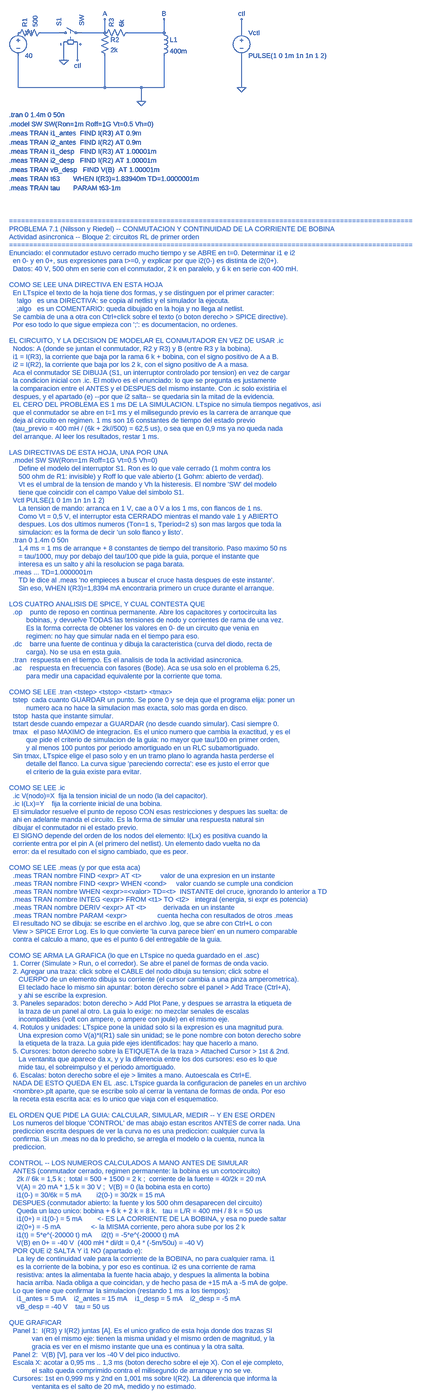
[diagram p0: schematic P7-01_conmutacion_continuidad_iL.asc, whole sheet]
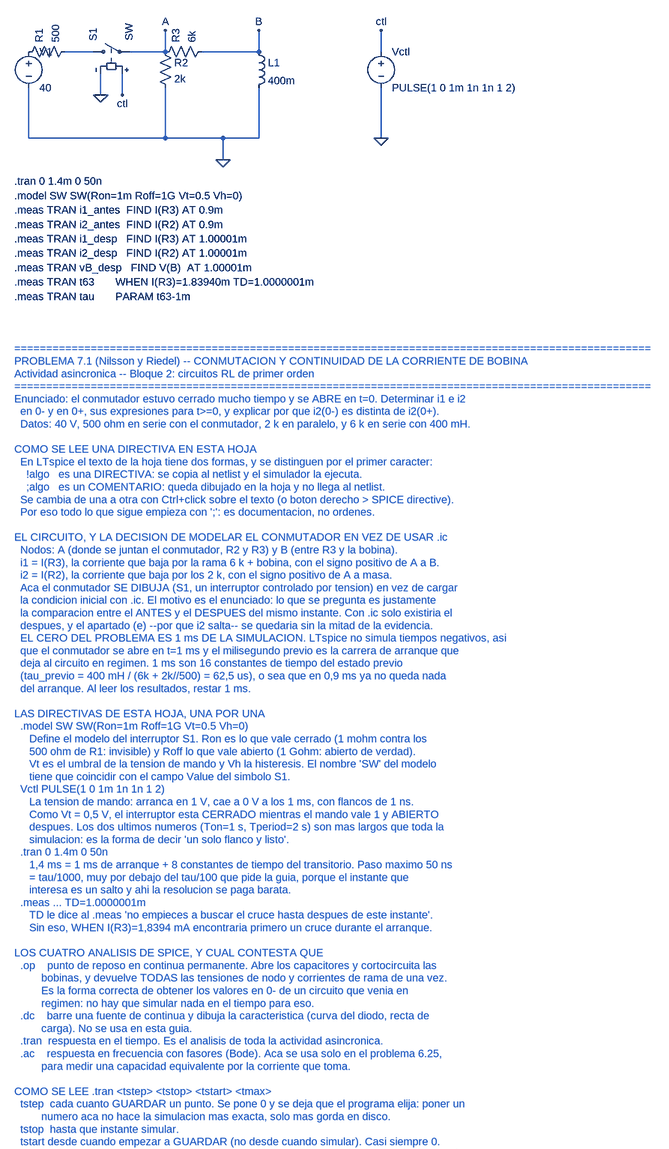
[diagram p1: schematic P7-01_conmutacion_continuidad_iL.asc, part, row 1 of 2, column 1 of 1]
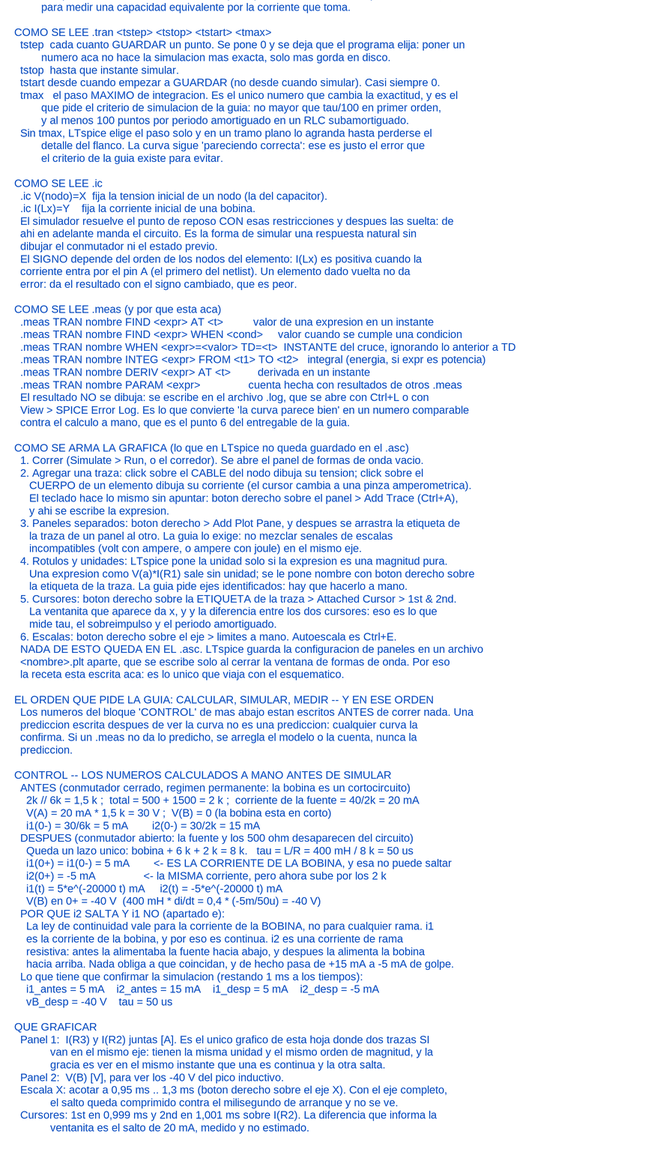
[diagram p2: schematic P7-01_conmutacion_continuidad_iL.asc, part, row 2 of 2, column 1 of 1]
P7-01_conmutacion_continuidad_iL.asc, the LTspice schematic file:
Version 4
SHEET 1 2000 2800
WIRE 96 192 96 304
WIRE 176 112 240 112
WIRE 320 112 400 112
WIRE 400 192 400 304
WIRE 480 112 608 112
WIRE 608 192 608 304
WIRE 96 304 608 304
WIRE 528 304 528 352
WIRE 400 112 400 64
WIRE 608 112 608 64
WIRE 256 160 256 208
WIRE 304 160 304 208
WIRE 880 112 880 64
WIRE 880 192 880 304
FLAG 528 352 0
FLAG 400 64 A
FLAG 608 64 B
FLAG 256 208 0
FLAG 304 208 ctl
FLAG 880 64 ctl
FLAG 880 304 0
SYMBOL voltage 96 96 R0
WINDOW 123 0 0 Left 0
WINDOW 39 0 0 Left 0
SYMATTR InstName V1
SYMATTR Value 40
SYMBOL res 80 128 R270
SYMATTR InstName R1
SYMATTR Value 500
SYMBOL sw 224 112 R270
SYMATTR InstName S1
SYMATTR Value SW
SYMBOL res 384 96 R0
SYMATTR InstName R2
SYMATTR Value 2k
SYMBOL res 384 128 R270
SYMATTR InstName R3
SYMATTR Value 6k
SYMBOL ind 592 96 R0
SYMATTR InstName L1
SYMATTR Value 400m
SYMATTR Value2 Rser=0
SYMBOL voltage 880 96 R0
WINDOW 123 0 0 Left 0
WINDOW 39 0 0 Left 0
SYMATTR InstName Vctl
SYMATTR Value PULSE(1 0 1m 1n 1n 1 2)
TEXT 64 400 Left 2 !.tran 0 1.4m 0 50n
TEXT 64 432 Left 2 !.model SW SW(Ron=1m Roff=1G Vt=0.5 Vh=0)
TEXT 64 464 Left 2 !.meas TRAN i1_antes  FIND I(R3) AT 0.9m
TEXT 64 496 Left 2 !.meas TRAN i2_antes  FIND I(R2) AT 0.9m
TEXT 64 528 Left 2 !.meas TRAN i1_desp   FIND I(R3) AT 1.00001m
TEXT 64 560 Left 2 !.meas TRAN i2_desp   FIND I(R2) AT 1.00001m
TEXT 64 592 Left 2 !.meas TRAN vB_desp   FIND V(B)  AT 1.00001m
TEXT 64 624 Left 2 !.meas TRAN t63       WHEN I(R3)=1.83940m TD=1.0000001m
TEXT 64 656 Left 2 !.meas TRAN tau       PARAM t63-1m
TEXT 64 900 Left 2 ;====================================================================================================
TEXT 64 928 Left 2 ;PROBLEMA 7.1 (Nilsson y Riedel) -- CONMUTACION Y CONTINUIDAD DE LA CORRIENTE DE BOBINA
TEXT 64 956 Left 2 ;Actividad asincronica -- Bloque 2: circuitos RL de primer orden
TEXT 64 984 Left 2 ;====================================================================================================
TEXT 64 1012 Left 2 ;Enunciado: el conmutador estuvo cerrado mucho tiempo y se ABRE en t=0. Determinar i1 e i2
TEXT 64 1040 Left 2 ;  en 0- y en 0+, sus expresiones para t>=0, y explicar por que i2(0-) es distinta de i2(0+).
TEXT 64 1068 Left 2 ;  Datos: 40 V, 500 ohm en serie con el conmutador, 2 k en paralelo, y 6 k en serie con 400 mH.
TEXT 64 1096 Left 2 ;
TEXT 64 1124 Left 2 ;COMO SE LEE UNA DIRECTIVA EN ESTA HOJA
TEXT 64 1152 Left 2 ;  En LTspice el texto de la hoja tiene dos formas, y se distinguen por el primer caracter:
TEXT 64 1180 Left 2 ;    !algo   es una DIRECTIVA: se copia al netlist y el simulador la ejecuta.
TEXT 64 1208 Left 2 ;    ;algo   es un COMENTARIO: queda dibujado en la hoja y no llega al netlist.
TEXT 64 1236 Left 2 ;  Se cambia de una a otra con Ctrl+click sobre el texto (o boton derecho > SPICE directive).
TEXT 64 1264 Left 2 ;  Por eso todo lo que sigue empieza con ';': es documentacion, no ordenes.
TEXT 64 1292 Left 2 ;
TEXT 64 1320 Left 2 ;EL CIRCUITO, Y LA DECISION DE MODELAR EL CONMUTADOR EN VEZ DE USAR .ic
TEXT 64 1348 Left 2 ;  Nodos: A (donde se juntan el conmutador, R2 y R3) y B (entre R3 y la bobina).
TEXT 64 1376 Left 2 ;  i1 = I(R3), la corriente que baja por la rama 6 k + bobina, con el signo positivo de A a B.
TEXT 64 1404 Left 2 ;  i2 = I(R2), la corriente que baja por los 2 k, con el signo positivo de A a masa.
TEXT 64 1432 Left 2 ;  Aca el conmutador SE DIBUJA (S1, un interruptor controlado por tension) en vez de cargar
TEXT 64 1460 Left 2 ;  la condicion inicial con .ic. El motivo es el enunciado: lo que se pregunta es justamente
TEXT 64 1488 Left 2 ;  la comparacion entre el ANTES y el DESPUES del mismo instante. Con .ic solo existiria el
TEXT 64 1516 Left 2 ;  despues, y el apartado (e) --por que i2 salta-- se quedaria sin la mitad de la evidencia.
TEXT 64 1544 Left 2 ;  EL CERO DEL PROBLEMA ES 1 ms DE LA SIMULACION. LTspice no simula tiempos negativos, asi
TEXT 64 1572 Left 2 ;  que el conmutador se abre en t=1 ms y el milisegundo previo es la carrera de arranque que
TEXT 64 1600 Left 2 ;  deja al circuito en regimen. 1 ms son 16 constantes de tiempo del estado previo
TEXT 64 1628 Left 2 ;  (tau_previo = 400 mH / (6k + 2k//500) = 62,5 us), o sea que en 0,9 ms ya no queda nada
TEXT 64 1656 Left 2 ;  del arranque. Al leer los resultados, restar 1 ms.
TEXT 64 1684 Left 2 ;
TEXT 64 1712 Left 2 ;LAS DIRECTIVAS DE ESTA HOJA, UNA POR UNA
TEXT 64 1740 Left 2 ;  .model SW SW(Ron=1m Roff=1G Vt=0.5 Vh=0)
TEXT 64 1768 Left 2 ;     Define el modelo del interruptor S1. Ron es lo que vale cerrado (1 mohm contra los
TEXT 64 1796 Left 2 ;     500 ohm de R1: invisible) y Roff lo que vale abierto (1 Gohm: abierto de verdad).
TEXT 64 1824 Left 2 ;     Vt es el umbral de la tension de mando y Vh la histeresis. El nombre 'SW' del modelo
TEXT 64 1852 Left 2 ;     tiene que coincidir con el campo Value del simbolo S1.
TEXT 64 1880 Left 2 ;  Vctl PULSE(1 0 1m 1n 1n 1 2)
TEXT 64 1908 Left 2 ;     La tension de mando: arranca en 1 V, cae a 0 V a los 1 ms, con flancos de 1 ns.
TEXT 64 1936 Left 2 ;     Como Vt = 0,5 V, el interruptor esta CERRADO mientras el mando vale 1 y ABIERTO
TEXT 64 1964 Left 2 ;     despues. Los dos ultimos numeros (Ton=1 s, Tperiod=2 s) son mas largos que toda la
TEXT 64 1992 Left 2 ;     simulacion: es la forma de decir 'un solo flanco y listo'.
TEXT 64 2020 Left 2 ;  .tran 0 1.4m 0 50n
TEXT 64 2048 Left 2 ;     1,4 ms = 1 ms de arranque + 8 constantes de tiempo del transitorio. Paso maximo 50 ns
TEXT 64 2076 Left 2 ;     = tau/1000, muy por debajo del tau/100 que pide la guia, porque el instante que
TEXT 64 2104 Left 2 ;     interesa es un salto y ahi la resolucion se paga barata.
TEXT 64 2132 Left 2 ;  .meas ... TD=1.0000001m
TEXT 64 2160 Left 2 ;     TD le dice al .meas 'no empieces a buscar el cruce hasta despues de este instante'.
TEXT 64 2188 Left 2 ;     Sin eso, WHEN I(R3)=1,8394 mA encontraria primero un cruce durante el arranque.
TEXT 64 2216 Left 2 ;
TEXT 64 2244 Left 2 ;LOS CUATRO ANALISIS DE SPICE, Y CUAL CONTESTA QUE
TEXT 64 2272 Left 2 ;  .op    punto de reposo en continua permanente. Abre los capacitores y cortocircuita las
TEXT 64 2300 Left 2 ;         bobinas, y devuelve TODAS las tensiones de nodo y corrientes de rama de una vez.
TEXT 64 2328 Left 2 ;         Es la forma correcta de obtener los valores en 0- de un circuito que venia en
TEXT 64 2356 Left 2 ;         regimen: no hay que simular nada en el tiempo para eso.
TEXT 64 2384 Left 2 ;  .dc    barre una fuente de continua y dibuja la caracteristica (curva del diodo, recta de
TEXT 64 2412 Left 2 ;         carga). No se usa en esta guia.
TEXT 64 2440 Left 2 ;  .tran  respuesta en el tiempo. Es el analisis de toda la actividad asincronica.
TEXT 64 2468 Left 2 ;  .ac    respuesta en frecuencia con fasores (Bode). Aca se usa solo en el problema 6.25,
TEXT 64 2496 Left 2 ;         para medir una capacidad equivalente por la corriente que toma.
TEXT 64 2524 Left 2 ;
TEXT 64 2552 Left 2 ;COMO SE LEE .tran <tstep> <tstop> <tstart> <tmax>
TEXT 64 2580 Left 2 ;  tstep  cada cuanto GUARDAR un punto. Se pone 0 y se deja que el programa elija: poner un
TEXT 64 2608 Left 2 ;         numero aca no hace la simulacion mas exacta, solo mas gorda en disco.
TEXT 64 2636 Left 2 ;  tstop  hasta que instante simular.
TEXT 64 2664 Left 2 ;  tstart desde cuando empezar a GUARDAR (no desde cuando simular). Casi siempre 0.
TEXT 64 2692 Left 2 ;  tmax   el paso MAXIMO de integracion. Es el unico numero que cambia la exactitud, y es el
TEXT 64 2720 Left 2 ;         que pide el criterio de simulacion de la guia: no mayor que tau/100 en primer orden,
TEXT 64 2748 Left 2 ;         y al menos 100 puntos por periodo amortiguado en un RLC subamortiguado.
TEXT 64 2776 Left 2 ;  Sin tmax, LTspice elige el paso solo y en un tramo plano lo agranda hasta perderse el
TEXT 64 2804 Left 2 ;         detalle del flanco. La curva sigue 'pareciendo correcta': ese es justo el error que
TEXT 64 2832 Left 2 ;         el criterio de la guia existe para evitar.
TEXT 64 2860 Left 2 ;
TEXT 64 2888 Left 2 ;COMO SE LEE .ic
TEXT 64 2916 Left 2 ;  .ic V(nodo)=X  fija la tension inicial de un nodo (la del capacitor).
TEXT 64 2944 Left 2 ;  .ic I(Lx)=Y    fija la corriente inicial de una bobina.
TEXT 64 2972 Left 2 ;  El simulador resuelve el punto de reposo CON esas restricciones y despues las suelta: de
TEXT 64 3000 Left 2 ;  ahi en adelante manda el circuito. Es la forma de simular una respuesta natural sin
TEXT 64 3028 Left 2 ;  dibujar el conmutador ni el estado previo.
TEXT 64 3056 Left 2 ;  El SIGNO depende del orden de los nodos del elemento: I(Lx) es positiva cuando la
TEXT 64 3084 Left 2 ;  corriente entra por el pin A (el primero del netlist). Un elemento dado vuelta no da
TEXT 64 3112 Left 2 ;  error: da el resultado con el signo cambiado, que es peor.
TEXT 64 3140 Left 2 ;
TEXT 64 3168 Left 2 ;COMO SE LEE .meas (y por que esta aca)
TEXT 64 3196 Left 2 ;  .meas TRAN nombre FIND <expr> AT <t>          valor de una expresion en un instante
TEXT 64 3224 Left 2 ;  .meas TRAN nombre FIND <expr> WHEN <cond>     valor cuando se cumple una condicion
TEXT 64 3252 Left 2 ;  .meas TRAN nombre WHEN <expr>=<valor> TD=<t>  INSTANTE del cruce, ignorando lo anterior a TD
TEXT 64 3280 Left 2 ;  .meas TRAN nombre INTEG <expr> FROM <t1> TO <t2>   integral (energia, si expr es potencia)
TEXT 64 3308 Left 2 ;  .meas TRAN nombre DERIV <expr> AT <t>         derivada en un instante
TEXT 64 3336 Left 2 ;  .meas TRAN nombre PARAM <expr>                cuenta hecha con resultados de otros .meas
TEXT 64 3364 Left 2 ;  El resultado NO se dibuja: se escribe en el archivo .log, que se abre con Ctrl+L o con
TEXT 64 3392 Left 2 ;  View > SPICE Error Log. Es lo que convierte 'la curva parece bien' en un numero comparable
TEXT 64 3420 Left 2 ;  contra el calculo a mano, que es el punto 6 del entregable de la guia.
TEXT 64 3448 Left 2 ;
TEXT 64 3476 Left 2 ;COMO SE ARMA LA GRAFICA (lo que en LTspice no queda guardado en el .asc)
TEXT 64 3504 Left 2 ;  1. Correr (Simulate > Run, o el corredor). Se abre el panel de formas de onda vacio.
TEXT 64 3532 Left 2 ;  2. Agregar una traza: click sobre el CABLE del nodo dibuja su tension; click sobre el
TEXT 64 3560 Left 2 ;     CUERPO de un elemento dibuja su corriente (el cursor cambia a una pinza amperometrica).
TEXT 64 3588 Left 2 ;     El teclado hace lo mismo sin apuntar: boton derecho sobre el panel > Add Trace (Ctrl+A),
TEXT 64 3616 Left 2 ;     y ahi se escribe la expresion.
TEXT 64 3644 Left 2 ;  3. Paneles separados: boton derecho > Add Plot Pane, y despues se arrastra la etiqueta de
TEXT 64 3672 Left 2 ;     la traza de un panel al otro. La guia lo exige: no mezclar senales de escalas
TEXT 64 3700 Left 2 ;     incompatibles (volt con ampere, o ampere con joule) en el mismo eje.
TEXT 64 3728 Left 2 ;  4. Rotulos y unidades: LTspice pone la unidad solo si la expresion es una magnitud pura.
TEXT 64 3756 Left 2 ;     Una expresion como V(a)*I(R1) sale sin unidad; se le pone nombre con boton derecho sobre
TEXT 64 3784 Left 2 ;     la etiqueta de la traza. La guia pide ejes identificados: hay que hacerlo a mano.
TEXT 64 3812 Left 2 ;  5. Cursores: boton derecho sobre la ETIQUETA de la traza > Attached Cursor > 1st & 2nd.
TEXT 64 3840 Left 2 ;     La ventanita que aparece da x, y y la diferencia entre los dos cursores: eso es lo que
TEXT 64 3868 Left 2 ;     mide tau, el sobreimpulso y el periodo amortiguado.
TEXT 64 3896 Left 2 ;  6. Escalas: boton derecho sobre el eje > limites a mano. Autoescala es Ctrl+E.
TEXT 64 3924 Left 2 ;  NADA DE ESTO QUEDA EN EL .asc. LTspice guarda la configuracion de paneles en un archivo
TEXT 64 3952 Left 2 ;  <nombre>.plt aparte, que se escribe solo al cerrar la ventana de formas de onda. Por eso
TEXT 64 3980 Left 2 ;  la receta esta escrita aca: es lo unico que viaja con el esquematico.
TEXT 64 4008 Left 2 ;
TEXT 64 4036 Left 2 ;EL ORDEN QUE PIDE LA GUIA: CALCULAR, SIMULAR, MEDIR -- Y EN ESE ORDEN
TEXT 64 4064 Left 2 ;  Los numeros del bloque 'CONTROL' de mas abajo estan escritos ANTES de correr nada. Una
TEXT 64 4092 Left 2 ;  prediccion escrita despues de ver la curva no es una prediccion: cualquier curva la
TEXT 64 4120 Left 2 ;  confirma. Si un .meas no da lo predicho, se arregla el modelo o la cuenta, nunca la
TEXT 64 4148 Left 2 ;  prediccion.
TEXT 64 4176 Left 2 ;
TEXT 64 4204 Left 2 ;CONTROL -- LOS NUMEROS CALCULADOS A MANO ANTES DE SIMULAR
TEXT 64 4232 Left 2 ;  ANTES (conmutador cerrado, regimen permanente: la bobina es un cortocircuito)
TEXT 64 4260 Left 2 ;    2k // 6k = 1,5 k ;  total = 500 + 1500 = 2 k ;  corriente de la fuente = 40/2k = 20 mA
TEXT 64 4288 Left 2 ;    V(A) = 20 mA * 1,5 k = 30 V ;  V(B) = 0 (la bobina esta en corto)
TEXT 64 4316 Left 2 ;    i1(0-) = 30/6k = 5 mA        i2(0-) = 30/2k = 15 mA
TEXT 64 4344 Left 2 ;  DESPUES (conmutador abierto: la fuente y los 500 ohm desaparecen del circuito)
TEXT 64 4372 Left 2 ;    Queda un lazo unico: bobina + 6 k + 2 k = 8 k.   tau = L/R = 400 mH / 8 k = 50 us
TEXT 64 4400 Left 2 ;    i1(0+) = i1(0-) = 5 mA        <- ES LA CORRIENTE DE LA BOBINA, y esa no puede saltar
TEXT 64 4428 Left 2 ;    i2(0+) = -5 mA                <- la MISMA corriente, pero ahora sube por los 2 k
TEXT 64 4456 Left 2 ;    i1(t) = 5*e^(-20000 t) mA     i2(t) = -5*e^(-20000 t) mA
TEXT 64 4484 Left 2 ;    V(B) en 0+ = -40 V  (400 mH * di/dt = 0,4 * (-5m/50u) = -40 V)
TEXT 64 4512 Left 2 ;  POR QUE i2 SALTA Y i1 NO (apartado e):
TEXT 64 4540 Left 2 ;    La ley de continuidad vale para la corriente de la BOBINA, no para cualquier rama. i1
TEXT 64 4568 Left 2 ;    es la corriente de la bobina, y por eso es continua. i2 es una corriente de rama
TEXT 64 4596 Left 2 ;    resistiva: antes la alimentaba la fuente hacia abajo, y despues la alimenta la bobina
TEXT 64 4624 Left 2 ;    hacia arriba. Nada obliga a que coincidan, y de hecho pasa de +15 mA a -5 mA de golpe.
TEXT 64 4652 Left 2 ;  Lo que tiene que confirmar la simulacion (restando 1 ms a los tiempos):
TEXT 64 4680 Left 2 ;    i1_antes = 5 mA    i2_antes = 15 mA    i1_desp = 5 mA    i2_desp = -5 mA
TEXT 64 4708 Left 2 ;    vB_desp = -40 V    tau = 50 us
TEXT 64 4736 Left 2 ;
TEXT 64 4764 Left 2 ;QUE GRAFICAR
TEXT 64 4792 Left 2 ;  Panel 1:  I(R3) y I(R2) juntas [A]. Es el unico grafico de esta hoja donde dos trazas SI
TEXT 64 4820 Left 2 ;            van en el mismo eje: tienen la misma unidad y el mismo orden de magnitud, y la
TEXT 64 4848 Left 2 ;            gracia es ver en el mismo instante que una es continua y la otra salta.
TEXT 64 4876 Left 2 ;  Panel 2:  V(B) [V], para ver los -40 V del pico inductivo.
TEXT 64 4904 Left 2 ;  Escala X: acotar a 0,95 ms .. 1,3 ms (boton derecho sobre el eje X). Con el eje completo,
TEXT 64 4932 Left 2 ;            el salto queda comprimido contra el milisegundo de arranque y no se ve.
TEXT 64 4960 Left 2 ;  Cursores: 1st en 0,999 ms y 2nd en 1,001 ms sobre I(R2). La diferencia que informa la
TEXT 64 4988 Left 2 ;            ventanita es el salto de 20 mA, medido y no estimado.

The netlist it stands for:
* P7-01_conmutacion_continuidad_iL.asc
V1 P001 0 40
R1 P001 N001 500
S1 N001 A ctl 0 SW
R2 A 0 2k
R3 A B 6k
L1 B 0 400m Rser=0
Vctl ctl 0 PULSE(1 0 1m 1n 1n 1 2)
.tran 0 1.4m 0 50n
.model SW SW(Ron=1m Roff=1G Vt=0.5 Vh=0)
.meas TRAN i1_antes  FIND I(R3) AT 0.9m
.meas TRAN i2_antes  FIND I(R2) AT 0.9m
.meas TRAN i1_desp   FIND I(R3) AT 1.00001m
.meas TRAN i2_desp   FIND I(R2) AT 1.00001m
.meas TRAN vB_desp   FIND V(B)  AT 1.00001m
.meas TRAN t63       WHEN I(R3)=1.83940m TD=1.0000001m
.meas TRAN tau       PARAM t63-1m
* ====================================================================================================
* PROBLEMA 7.1 (Nilsson y Riedel) -- CONMUTACION Y CONTINUIDAD DE LA CORRIENTE DE BOBINA
* Actividad asincronica -- Bloque 2: circuitos RL de primer orden
* ====================================================================================================
* Enunciado: el conmutador estuvo cerrado mucho tiempo y se ABRE en t=0. Determinar i1 e i2
*   en 0- y en 0+, sus expresiones para t>=0, y explicar por que i2(0-) es distinta de i2(0+).
*   Datos: 40 V, 500 ohm en serie con el conmutador, 2 k en paralelo, y 6 k en serie con 400 mH.
* COMO SE LEE UNA DIRECTIVA EN ESTA HOJA
*   En LTspice el texto de la hoja tiene dos formas, y se distinguen por el primer caracter:
*     !algo   es una DIRECTIVA: se copia al netlist y el simulador la ejecuta.
*     ;algo   es un COMENTARIO: queda dibujado en la hoja y no llega al netlist.
*   Se cambia de una a otra con Ctrl+click sobre el texto (o boton derecho > SPICE directive).
*   Por eso todo lo que sigue empieza con ';': es documentacion, no ordenes.
* EL CIRCUITO, Y LA DECISION DE MODELAR EL CONMUTADOR EN VEZ DE USAR .ic
*   Nodos: A (donde se juntan el conmutador, R2 y R3) y B (entre R3 y la bobina).
*   i1 = I(R3), la corriente que baja por la rama 6 k + bobina, con el signo positivo de A a B.
*   i2 = I(R2), la corriente que baja por los 2 k, con el signo positivo de A a masa.
*   Aca el conmutador SE DIBUJA (S1, un interruptor controlado por tension) en vez de cargar
*   la condicion inicial con .ic. El motivo es el enunciado: lo que se pregunta es justamente
*   la comparacion entre el ANTES y el DESPUES del mismo instante. Con .ic solo existiria el
*   despues, y el apartado (e) --por que i2 salta-- se quedaria sin la mitad de la evidencia.
*   EL CERO DEL PROBLEMA ES 1 ms DE LA SIMULACION. LTspice no simula tiempos negativos, asi
*   que el conmutador se abre en t=1 ms y el milisegundo previo es la carrera de arranque que
*   deja al circuito en regimen. 1 ms son 16 constantes de tiempo del estado previo
*   (tau_previo = 400 mH / (6k + 2k//500) = 62,5 us), o sea que en 0,9 ms ya no queda nada
*   del arranque. Al leer los resultados, restar 1 ms.
* LAS DIRECTIVAS DE ESTA HOJA, UNA POR UNA
*   .model SW SW(Ron=1m Roff=1G Vt=0.5 Vh=0)
*      Define el modelo del interruptor S1. Ron es lo que vale cerrado (1 mohm contra los
*      500 ohm de R1: invisible) y Roff lo que vale abierto (1 Gohm: abierto de verdad).
*      Vt es el umbral de la tension de mando y Vh la histeresis. El nombre 'SW' del modelo
*      tiene que coincidir con el campo Value del simbolo S1.
*   Vctl PULSE(1 0 1m 1n 1n 1 2)
*      La tension de mando: arranca en 1 V, cae a 0 V a los 1 ms, con flancos de 1 ns.
*      Como Vt = 0,5 V, el interruptor esta CERRADO mientras el mando vale 1 y ABIERTO
*      despues. Los dos ultimos numeros (Ton=1 s, Tperiod=2 s) son mas largos que toda la
*      simulacion: es la forma de decir 'un solo flanco y listo'.
*   .tran 0 1.4m 0 50n
*      1,4 ms = 1 ms de arranque + 8 constantes de tiempo del transitorio. Paso maximo 50 ns
*      = tau/1000, muy por debajo del tau/100 que pide la guia, porque el instante que
*      interesa es un salto y ahi la resolucion se paga barata.
*   .meas ... TD=1.0000001m
*      TD le dice al .meas 'no empieces a buscar el cruce hasta despues de este instante'.
*      Sin eso, WHEN I(R3)=1,8394 mA encontraria primero un cruce durante el arranque.
* LOS CUATRO ANALISIS DE SPICE, Y CUAL CONTESTA QUE
*   .op    punto de reposo en continua permanente. Abre los capacitores y cortocircuita las
*          bobinas, y devuelve TODAS las tensiones de nodo y corrientes de rama de una vez.
*          Es la forma correcta de obtener los valores en 0- de un circuito que venia en
*          regimen: no hay que simular nada en el tiempo para eso.
*   .dc    barre una fuente de continua y dibuja la caracteristica (curva del diodo, recta de
*          carga). No se usa en esta guia.
*   .tran  respuesta en el tiempo. Es el analisis de toda la actividad asincronica.
*   .ac    respuesta en frecuencia con fasores (Bode). Aca se usa solo en el problema 6.25,
*          para medir una capacidad equivalente por la corriente que toma.
* COMO SE LEE .tran <tstep> <tstop> <tstart> <tmax>
*   tstep  cada cuanto GUARDAR un punto. Se pone 0 y se deja que el programa elija: poner un
*          numero aca no hace la simulacion mas exacta, solo mas gorda en disco.
*   tstop  hasta que instante simular.
*   tstart desde cuando empezar a GUARDAR (no desde cuando simular). Casi siempre 0.
*   tmax   el paso MAXIMO de integracion. Es el unico numero que cambia la exactitud, y es el
*          que pide el criterio de simulacion de la guia: no mayor que tau/100 en primer orden,
*          y al menos 100 puntos por periodo amortiguado en un RLC subamortiguado.
*   Sin tmax, LTspice elige el paso solo y en un tramo plano lo agranda hasta perderse el
*          detalle del flanco. La curva sigue 'pareciendo correcta': ese es justo el error que
*          el criterio de la guia existe para evitar.
* COMO SE LEE .ic
*   .ic V(nodo)=X  fija la tension inicial de un nodo (la del capacitor).
*   .ic I(Lx)=Y    fija la corriente inicial de una bobina.
*   El simulador resuelve el punto de reposo CON esas restricciones y despues las suelta: de
*   ahi en adelante manda el circuito. Es la forma de simular una respuesta natural sin
*   dibujar el conmutador ni el estado previo.
*   El SIGNO depende del orden de los nodos del elemento: I(Lx) es positiva cuando la
*   corriente entra por el pin A (el primero del netlist). Un elemento dado vuelta no da
*   error: da el resultado con el signo cambiado, que es peor.
* COMO SE LEE .meas (y por que esta aca)
*   .meas TRAN nombre FIND <expr> AT <t>          valor de una expresion en un instante
*   .meas TRAN nombre FIND <expr> WHEN <cond>     valor cuando se cumple una condicion
*   .meas TRAN nombre WHEN <expr>=<valor> TD=<t>  INSTANTE del cruce, ignorando lo anterior a TD
*   .meas TRAN nombre INTEG <expr> FROM <t1> TO <t2>   integral (energia, si expr es potencia)
*   .meas TRAN nombre DERIV <expr> AT <t>         derivada en un instante
*   .meas TRAN nombre PARAM <expr>                cuenta hecha con resultados de otros .meas
*   El resultado NO se dibuja: se escribe en el archivo .log, que se abre con Ctrl+L o con
*   View > SPICE Error Log. Es lo que convierte 'la curva parece bien' en un numero comparable
*   contra el calculo a mano, que es el punto 6 del entregable de la guia.
* COMO SE ARMA LA GRAFICA (lo que en LTspice no queda guardado en el .asc)
*   1. Correr (Simulate > Run, o el corredor). Se abre el panel de formas de onda vacio.
*   2. Agregar una traza: click sobre el CABLE del nodo dibuja su tension; click sobre el
*      CUERPO de un elemento dibuja su corriente (el cursor cambia a una pinza amperometrica).
*      El teclado hace lo mismo sin apuntar: boton derecho sobre el panel > Add Trace (Ctrl+A),
*      y ahi se escribe la expresion.
*   3. Paneles separados: boton derecho > Add Plot Pane, y despues se arrastra la etiqueta de
*      la traza de un panel al otro. La guia lo exige: no mezclar senales de escalas
*      incompatibles (volt con ampere, o ampere con joule) en el mismo eje.
*   4. Rotulos y unidades: LTspice pone la unidad solo si la expresion es una magnitud pura.
*      Una expresion como V(a)*I(R1) sale sin unidad; se le pone nombre con boton derecho sobre
*      la etiqueta de la traza. La guia pide ejes identificados: hay que hacerlo a mano.
*   5. Cursores: boton derecho sobre la ETIQUETA de la traza > Attached Cursor > 1st & 2nd.
*      La ventanita que aparece da x, y y la diferencia entre los dos cursores: eso es lo que
*      mide tau, el sobreimpulso y el periodo amortiguado.
*   6. Escalas: boton derecho sobre el eje > limites a mano. Autoescala es Ctrl+E.
*   NADA DE ESTO QUEDA EN EL .asc. LTspice guarda la configuracion de paneles en un archivo
*   <nombre>.plt aparte, que se escribe solo al cerrar la ventana de formas de onda. Por eso
*   la receta esta escrita aca: es lo unico que viaja con el esquematico.
* EL ORDEN QUE PIDE LA GUIA: CALCULAR, SIMULAR, MEDIR -- Y EN ESE ORDEN
*   Los numeros del bloque 'CONTROL' de mas abajo estan escritos ANTES de correr nada. Una
*   prediccion escrita despues de ver la curva no es una prediccion: cualquier curva la
*   confirma. Si un .meas no da lo predicho, se arregla el modelo o la cuenta, nunca la
*   prediccion.
* CONTROL -- LOS NUMEROS CALCULADOS A MANO ANTES DE SIMULAR
*   ANTES (conmutador cerrado, regimen permanente: la bobina es un cortocircuito)
*     2k // 6k = 1,5 k ;  total = 500 + 1500 = 2 k ;  corriente de la fuente = 40/2k = 20 mA
*     V(A) = 20 mA * 1,5 k = 30 V ;  V(B) = 0 (la bobina esta en corto)
*     i1(0-) = 30/6k = 5 mA        i2(0-) = 30/2k = 15 mA
*   DESPUES (conmutador abierto: la fuente y los 500 ohm desaparecen del circuito)
*     Queda un lazo unico: bobina + 6 k + 2 k = 8 k.   tau = L/R = 400 mH / 8 k = 50 us
*     i1(0+) = i1(0-) = 5 mA        <- ES LA CORRIENTE DE LA BOBINA, y esa no puede saltar
*     i2(0+) = -5 mA                <- la MISMA corriente, pero ahora sube por los 2 k
*     i1(t) = 5*e^(-20000 t) mA     i2(t) = -5*e^(-20000 t) mA
*     V(B) en 0+ = -40 V  (400 mH * di/dt = 0,4 * (-5m/50u) = -40 V)
*   POR QUE i2 SALTA Y i1 NO (apartado e):
*     La ley de continuidad vale para la corriente de la BOBINA, no para cualquier rama. i1
*     es la corriente de la bobina, y por eso es continua. i2 es una corriente de rama
*     resistiva: antes la alimentaba la fuente hacia abajo, y despues la alimenta la bobina
*     hacia arriba. Nada obliga a que coincidan, y de hecho pasa de +15 mA a -5 mA de golpe.
*   Lo que tiene que confirmar la simulacion (restando 1 ms a los tiempos):
*     i1_antes = 5 mA    i2_antes = 15 mA    i1_desp = 5 mA    i2_desp = -5 mA
*     vB_desp = -40 V    tau = 50 us
* QUE GRAFICAR
*   Panel 1:  I(R3) y I(R2) juntas [A]. Es el unico grafico de esta hoja donde dos trazas SI
*             van en el mismo eje: tienen la misma unidad y el mismo orden de magnitud, y la
*             gracia es ver en el mismo instante que una es continua y la otra salta.
*   Panel 2:  V(B) [V], para ver los -40 V del pico inductivo.
*   Escala X: acotar a 0,95 ms .. 1,3 ms (boton derecho sobre el eje X). Con el eje completo,
*             el salto queda comprimido contra el milisegundo de arranque y no se ve.
*   Cursores: 1st en 0,999 ms y 2nd en 1,001 ms sobre I(R2). La diferencia que informa la
*             ventanita es el salto de 20 mA, medido y no estimado.
.backanno
.end